# EAGLE design PMT Protector For Optical Stim Gamma1a (EAGLE 8.7.0)

## Sheet 1 of 2
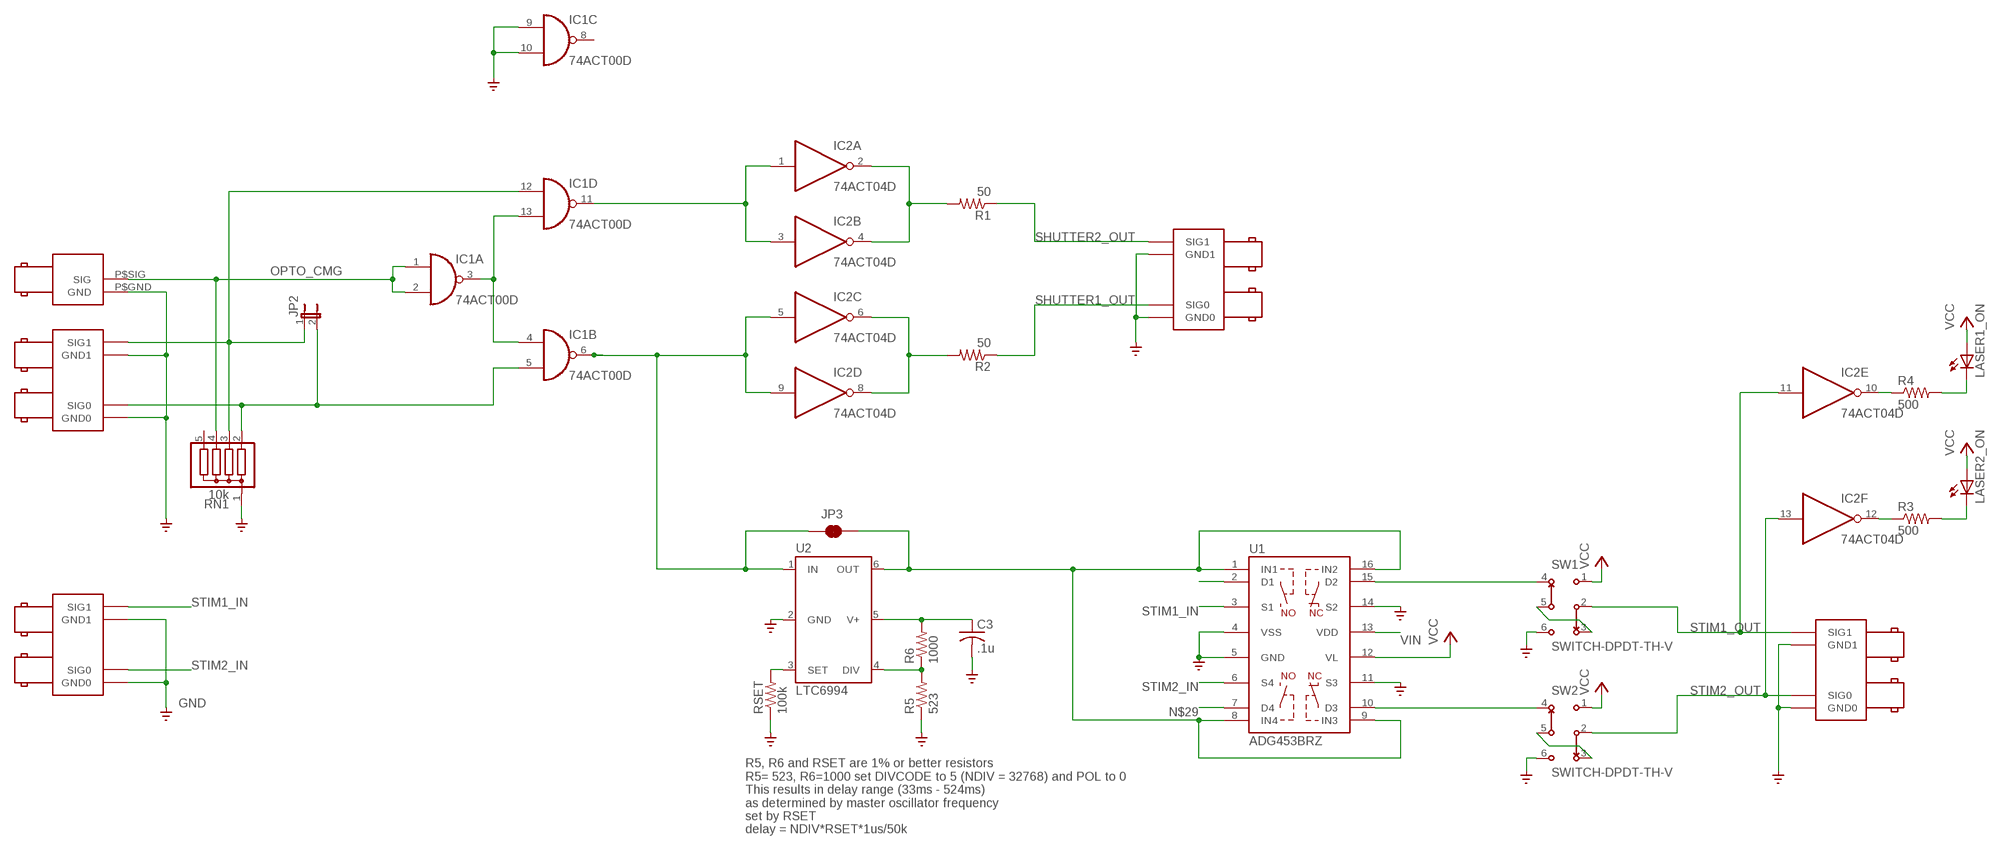
[diagram p0: schematic, sheet 1]

### Parts
C3  .1u  C-USC0805K  [C0805K]
IC1  74ACT00D  [SO14]
IC2  74ACT04D  [SO14]
JP2  JP1E  [JP1]
JP3  JUMPER-SMT_2_NC_TRACE_SILK  [SMT-JUMPER_2_NC_TRACE_SILK]
LASER1_ON  LED5MM  [LED5MM]
LASER2_ON  LED5MM  [LED5MM]
OPTO_CMG  BNC_RIGHT_ANGLE  [BNC_RIGHT_ANGLE]
R1  50  R-US_R0805  [R0805]
R2  50  R-US_R0805  [R0805]
R3  500  R-US_R0805  [R0805]
R4  500  R-US_R0805  [R0805]
R5  523  R-US_R0805  [R0805]
R6  1000  R-US_R0805  [R0805]
RN1  10k  G04R  [SIL5]
RSET  100k  R-US_R0805  [R0805]
SHTR_IN  BNC_RIGHT_ANGLE_DOUBLE  [BNC_RIGHT_ANGLE_DOUBLE]
SHTR_OUT  BNC_RIGHT_ANGLE_DOUBLE  [BNC_RIGHT_ANGLE_DOUBLE]
STIM_IN  BNC_RIGHT_ANGLE_DOUBLE  [BNC_RIGHT_ANGLE_DOUBLE]
STIM_OUT  BNC_RIGHT_ANGLE_DOUBLE  [BNC_RIGHT_ANGLE_DOUBLE]
SW1  SWITCH-DPDT-TH-V  [SWITCH-DPDT]
SW2  SWITCH-DPDT-TH-V  [SWITCH-DPDT]
U1  ADG453BRZ  [SO16]
U2  LTC6994  TIMERBLOX_LTC6994SOT-23  [SOT23-6]

### Nets
GND: C3.2 IC1.9(C:I0) IC1.10(C:I1) OPTO_CMG.P$GND(GND) R5.1 RN1.1 RSET.1 SHTR_IN.P$GND0(GND0) SHTR_IN.P$GND1(GND1) SHTR_OUT.P$GND0(GND0) SHTR_OUT.P$GND1(GND1) STIM_IN.P$GND0(GND0) STIM_IN.P$GND1(GND1) STIM_OUT.P$GND0(GND0) STIM_OUT.P$GND1(GND1) SW1.6 SW2.6 U1.4(VSS) U1.5(GND) U1.11(S3) U1.14(S2) U2.2(GND) ; also sheet 2
N$1: IC1.12(D:I0) JP2.1 RN1.3 SHTR_IN.P$SIG1(SIG1)
N$2: IC2.12(F:O) R3.1
N$3: IC1.6(B:O) IC2.5(C:I) IC2.9(D:I) JP3.1 U2.1(IN)
N$4: IC2.2(A:O) IC2.4(B:O) R1.2
N$5: IC2.10(E:O) R4.1
N$6: LASER1_ON.K(C) R4.2
N$7: LASER2_ON.K(C) R3.2
N$8: SW2.3 SW2.5
N$9: IC1.11(D:O) IC2.1(A:I) IC2.3(B:I)
N$11: IC2.6(C:O) IC2.8(D:O) R2.2
N$23: IC1.3(A:O) IC1.4(B:I0) IC1.13(D:I1)
N$29: SW2.4 U1.7(D4) U1.10(D3)
N$33: JP3.2 U1.1(IN1) U1.8(IN4) U1.9(IN3) U1.16(IN2) U2.6(OUT)
N$34: SW1.3 SW1.5
N$35: SW1.4 U1.2(D1) U1.15(D2)
N$41: R5.2 R6.1 U2.4(DIV)
N$42: RSET.2 U2.3(SET)
OPTO_CMG: IC1.1(A:I0) IC1.2(A:I1) OPTO_CMG.P$SIG(SIG) RN1.4
SHUTTER1_OUT: R2.1 SHTR_OUT.P$SIG0(SIG0)
SHUTTER2_OUT: R1.1 SHTR_OUT.P$SIG1(SIG1)
SHUTTER_IN: IC1.5(B:I1) JP2.2 RN1.2 SHTR_IN.P$SIG0(SIG0)
STIM1_IN: STIM_IN.P$SIG1(SIG1) U1.3(S1)
STIM1_OUT: IC2.11(E:I) STIM_OUT.P$SIG1(SIG1) SW1.2
STIM2_IN: STIM_IN.P$SIG0(SIG0) U1.6(S4)
STIM2_OUT: IC2.13(F:I) STIM_OUT.P$SIG0(SIG0) SW2.2
VCC: LASER1_ON.A LASER2_ON.A SW1.1 SW2.1 U1.12(VL) ; also sheet 2
VCC2: C3.1 R6.2 U2.5(V+)
VIN: U1.13(VDD) ; also sheet 2
Unconnected: IC1.8(C:O) RN1.5

### Notes on the sheet
- R5, R6 and RSET are 1% or better resistors 
  R5= 523, R6=1000 set DIVCODE to 5 (NDIV = 32768) and POL to 0
  This results in delay range (33ms - 524ms)
  as determined by master oscillator frequency
  set by RSET
  delay = NDIV*RSET*1us/50k

## Sheet 2 of 2
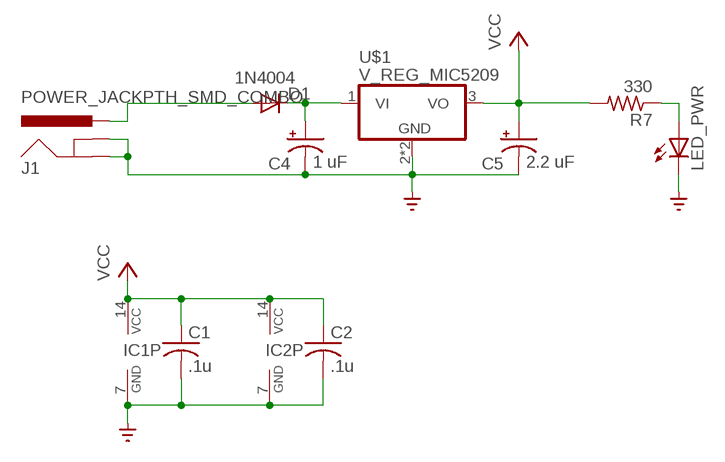
[diagram p1: schematic, sheet 2]

### Parts
C1  .1u  C-USC0805K  [C0805K]
C2  .1u  C-USC0805K  [C0805K]
C4  1 uF  CPOL-USE2.5-5  [E2,5-5]
C5  2.2 uF  CPOL-USE2.5-5  [E2,5-5]
D1  1N4004  [DO41-10]
J1  POWER_JACKPTH_SMD_COMBO  [POWER_JACK_COMBO]
LED_PWR  LED5MM  [LED5MM]
R7  330  R-US_R0805  [R0805]
U$1  V_REG_MIC5209  [SOT-223]

### Nets
GND: C1.2 C2.2 C4.- C5.- IC1.7(P:GND) IC2.7(P:GND) J1.GND(GNDBREAK) J1.GND@1(GND) LED_PWR.K(C) U$1.2(GND) U$1.4(GND) ; also sheet 1
N$31: D1.A J1.POWER(PWR)
N$61: LED_PWR.A R7.1
VCC: C1.1 C2.1 C5.+ IC1.14(P:VCC) IC2.14(P:VCC) R7.2 U$1.3(VO) ; also sheet 1
VIN: C4.+ D1.C U$1.1(VI) ; also sheet 1

## Library data of the parts
C1-C3 = adafruit:C-US: CAPACITOR, American symbol
C4 C5 = adafruit:CPOL-US: POLARIZED CAPACITOR, American symbol
D1 = adafruit:1N4004: DIODE General purpose 1N400x type rectifier (With bigger pads) http://www.ladyada.net/library/pcb/eaglelibrary.html
IC1 = 74xx-eu:74*00: Quad 2-input NAND gate
IC2 = 74xx-eu:74*04: Hex INVERTER
J1 = SparkFun-Connectors:POWER_JACK: Power Jack Connector This is the standard 5.5mm barrel jack for power. The PTH is the most common, proven, reliable, footprint. The Slot footprint only works if the mill layer is transmitted to the PCB fab house so be warned. Here are the connectors we sell at SparkFun: DC Barrel Power Jack/Connector <https://www.sparkfun.com/products/119> (PRT-00119) DC Barrel Power Jack/Connector (SMD) <https://www.sparkfun.com/products/12748> (PRT-12748) DC Barrel Jack Adapter - Breadboard Compatible <https://www.sparkfun.com/products/10811> (PRT-10811) It is used on this SparkFun product (and many, many others): SparkFun RedBoard - Programmed with Arduino <https://www.sparkfun.com/products/12757> (DEV-12757) Also, if you need a mating power supply or connector, please check these out: Wall Adapter Power Supply - 9VDC 650mA <https://www.sparkfun.com/products/298> (TOL-00298) DC Barrel Jack Adapter - Male <https://www.sparkfun.com/products/10287> (PRT-10287)
JP2 = jumper:JP1E: JUMPER
JP3 = SparkFun-Jumpers:JUMPER-SMT_2_NC_TRACE: Normally closed trace jumper This jumper has a trace between two pads so it's normally closed (NC). Use a razor knife to open the connection. For best results follow the IPC guidelines for cutting traces: Cutout at least 0.063 mm (0.005 in). Remove all loose material to clean up the cut area. Seal the cut with an approved epoxy. Reapply solder to reclose the connection.
LASER1_ON LASER2_ON LED_PWR = adafruit:LED: LED OSRAM: - CHIPLED LG R971, LG N971, LY N971, LG Q971, LY Q971, LO R971, LY R971 LH N974, LH R974 LS Q976, LO Q976, LY Q976 LO Q996 - Hyper CHIPLED LW Q18S LB Q993, LB Q99A, LB R99A - SideLED LS A670, LO A670, LY A670, LG A670, LP A670 LB A673, LV A673, LT A673, LW A673 LH A674 LY A675 LS A676, LA A676, LO A676, LY A676, LW A676 LS A679, LY A679, LG A679 - Hyper Micro SIDELED® LS Y876, LA Y876, LO Y876, LY Y876 LT Y87S - SmartLED LW L88C, LW L88S LB L89C, LB L89S, LG L890 LS L89K, LO L89K, LY L89K LS L896, LA L896, LO L896, LY L896 - TOPLED LS T670, LO T670, LY T670, LG T670, LP T670 LSG T670, LSP T670, LSY T670, LOP T670, LYG T670 LG T671, LOG T671, LSG T671 LB T673, LV T673, LT T673, LW T673 LH T674 LS T676, LA T676, LO T676, LY T676, LB T676, LH T676, LSB T676, LW T676 LB T67C, LV T67C, LT T67C, LS T67K, LO T67K, LY T67K, LW E67C LS E67B, LA E67B, LO E67B, LY E67B, LB E67C, LV E67C, LT E67C LW T67C LS T679, LY T679, LG T679 LS T770, LO T770, LY T770, LG T770, LP T770 LB T773, LV T773, LT T773, LW T773 LH T774 LS E675, LA E675, LY E675, LS T675 LS T776, LA T776, LO T776, LY T776, LB T776 LHGB T686 LT T68C, LB T68C - Hyper Mini TOPLED® LB M676 - Mini TOPLED Santana® LG M470 LS M47K, LO M47K, LY M47K Source: http://www.osram.convergy.de/
OPTO_CMG = connectors:BNC_RIGHT_ANGLE: BNC plug, through-hole, right-angle
R1-R7 RSET = rcl:R-US_: RESISTOR, American symbol; SPICEPREFIX: R
RN1 = resistor-sil:G04R: SIL RESISTOR; OC_FARNELL: unknown; OC_NEWARK: unknown
SHTR_IN SHTR_OUT STIM_IN STIM_OUT = Pavel_Connectors:BNC_RIGHT_ANGLE_DOUBLE
SW1 SW2 = Pavel_ElectroMechanical:SWITCH-DPDT-TH-V: Switch DPDT E-Switch Series 100 DP6 Product https://www.digikey.com/product-detail/en/e-switch/100DP6T1B1M1RE/100DP6T1B1M1RE-ND/3777875 To wire as 3-way SP3T, connect pin 3 and pin 5
U1 = adg451_adg452_adg453:ADG453?: ANALOG DEVICES ADG453 LC2MOS SPST SWITCHES: 2 x NC, 2 x NO "Case View" D=Drain, S=Source Case-Styles BRZ: SOIC 16 Standard Author: Dipl.-Ing. FH Rainer Bayer, rainer.bayer@hs-heilbronn.de
U2 = Pavel_ICs:TIMERBLOX_LTC6994: Liner Technology TimerBlox Delay Block LTC6994, SOT23-6; PROD_ID: IC-08886; VALUE: MCP4725
U$1 = Pavel-PowerIC:V_REG_MIC5209

## Board
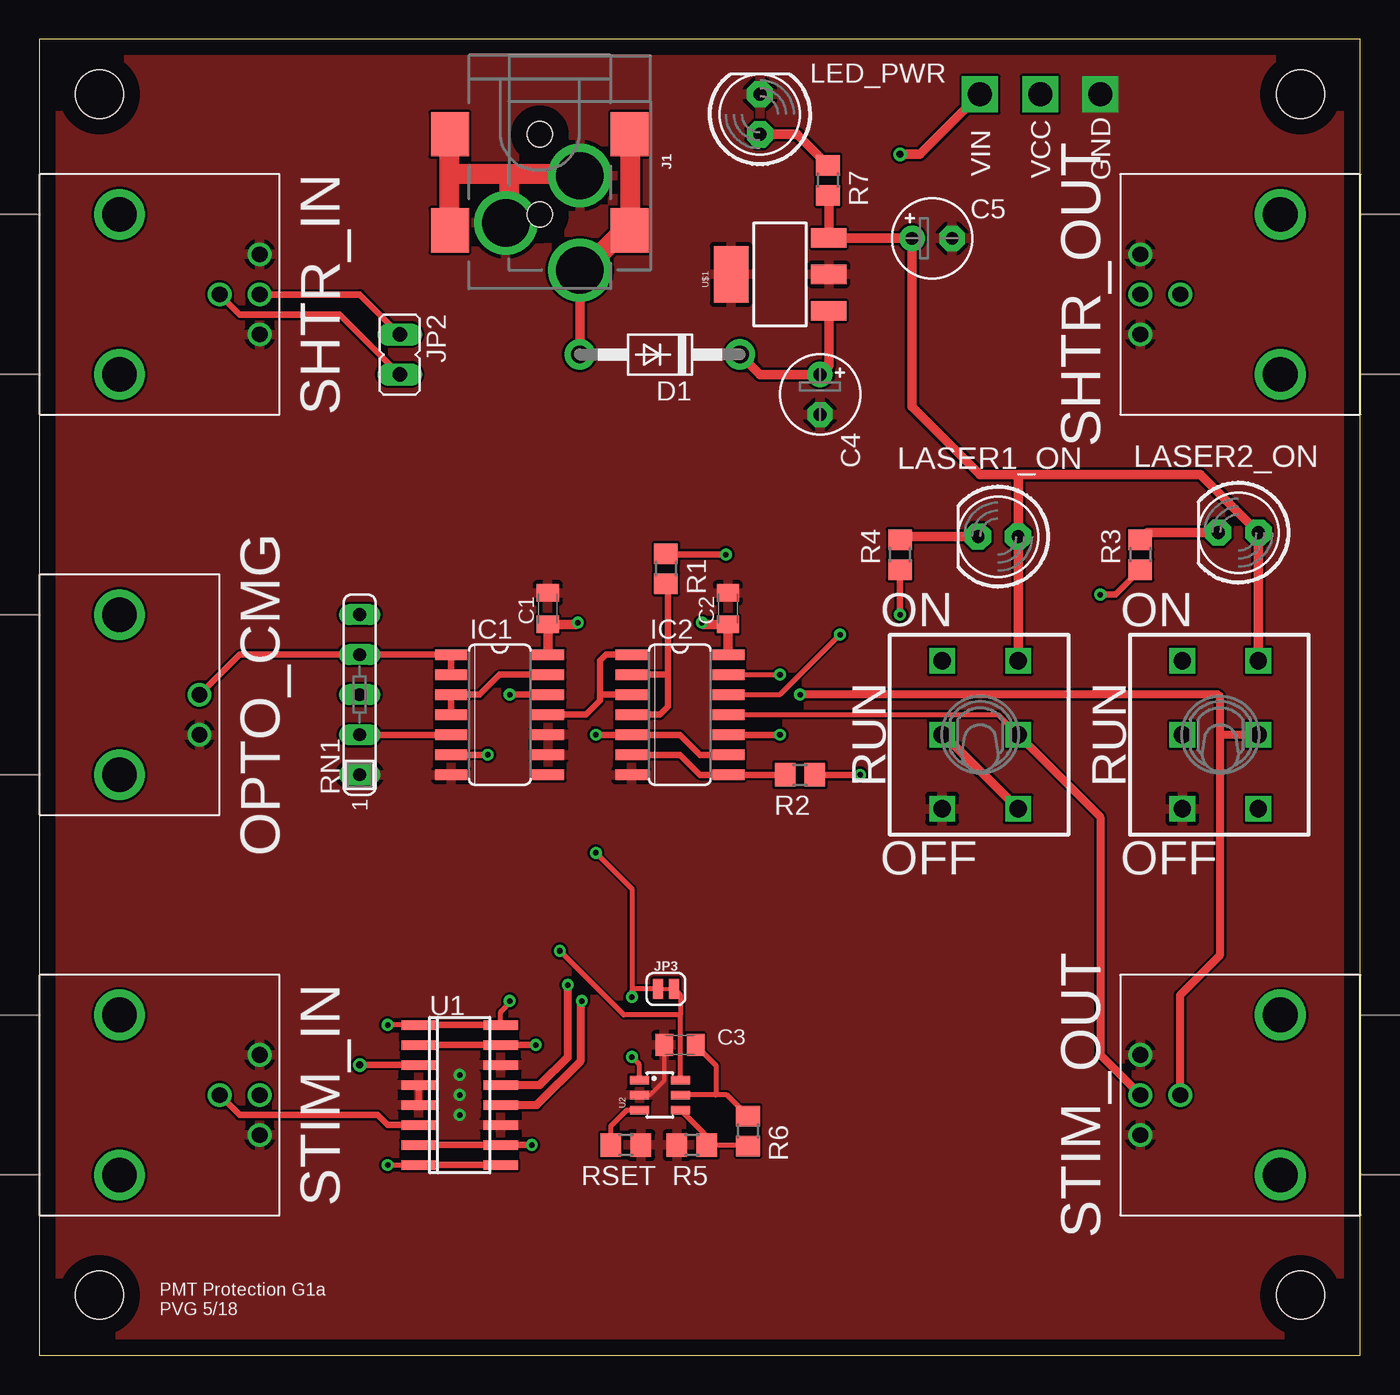
[diagram p2: board, top side]
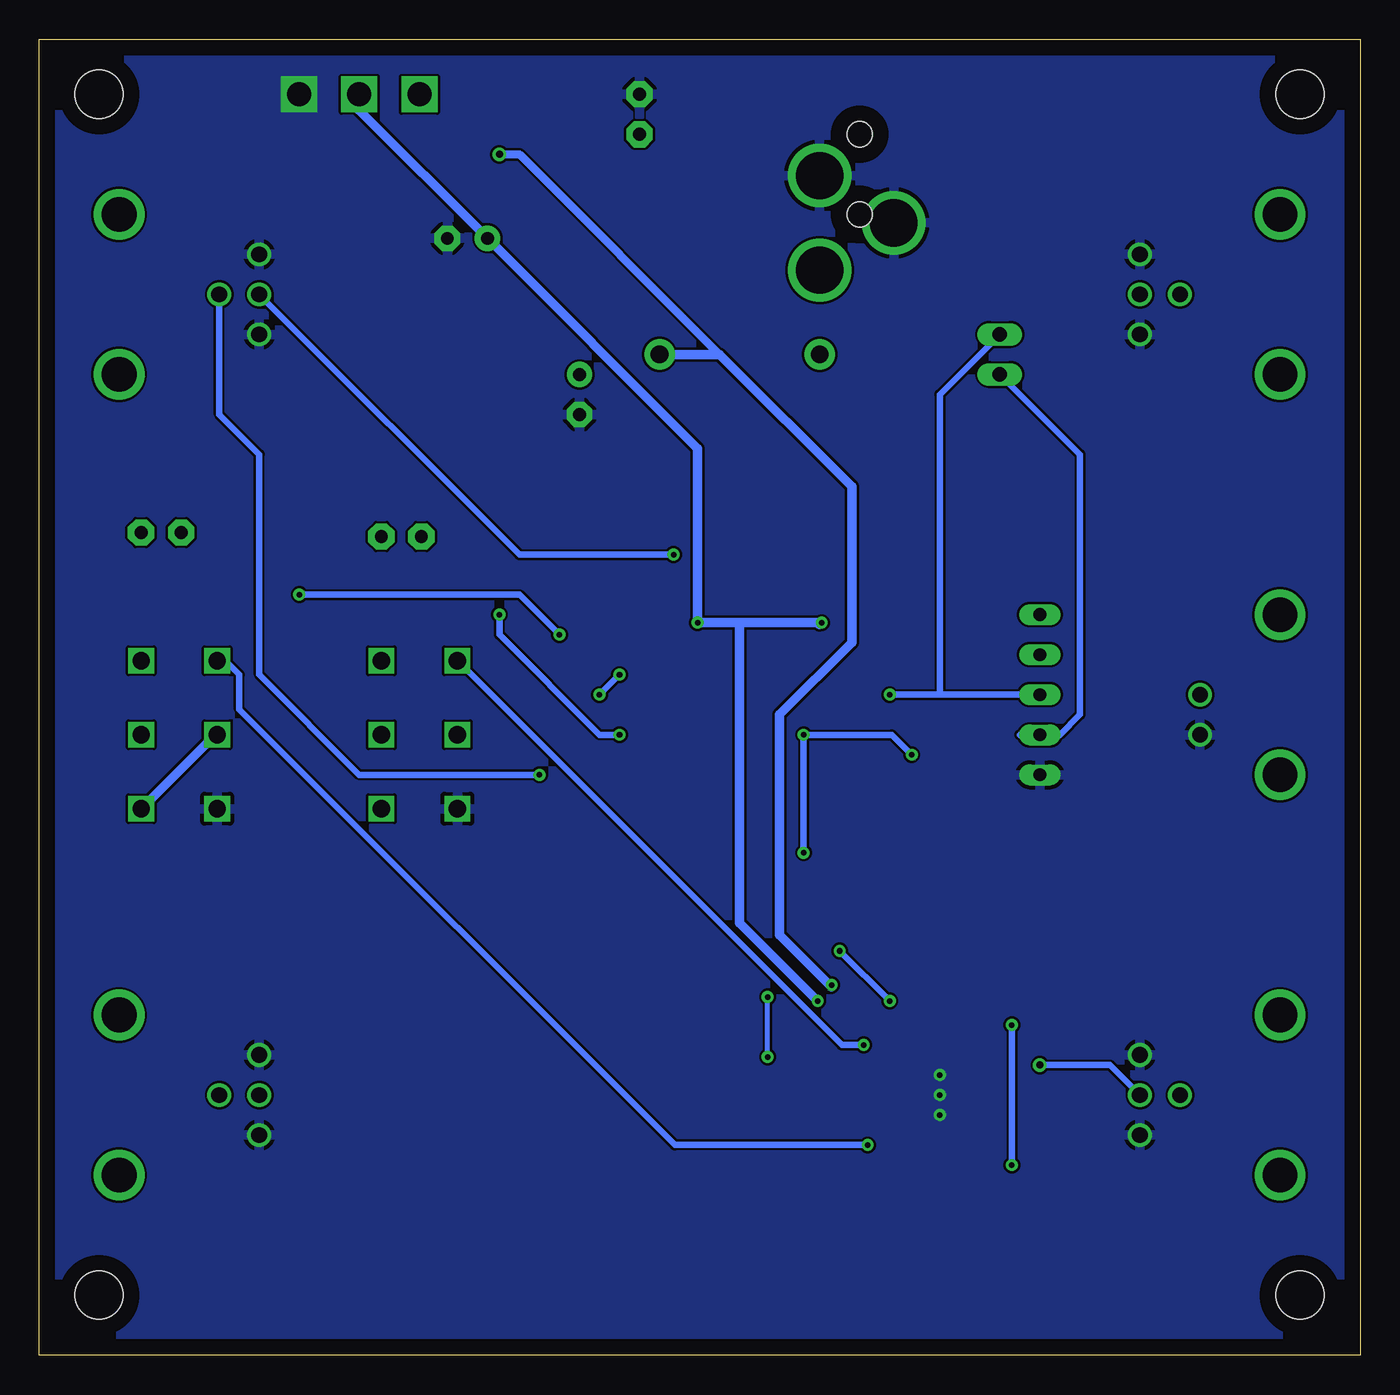
[diagram p3: board, bottom side, seen from below]

Size 83.8 x 83.49 mm. Coordinates in mm from the lower left corner, seen from the top.
Outline: 0,0 83.8,0 83.8,83.49 0,83.49 0,0
Copper layers (1*16): Top 0.035mm / dielectric 1.5mm / Bottom 0.035mm
Design rules "default": minimum track width 6mil, minimum drill 0.35mm, track to track 6mil, track to pad 6mil, pad to pad 6mil, via to via 6mil, smd to smd 6mil, copper to edge 40mil, drill to drill 6mil, minimum pad ring 10mil, minimum via ring 8mil, stop-mask expansion 4mil, vias tented up to drill 0mil, thermal gap 10mil
Holes 3.05 mm at 3.81,3.81 80.01,80.01 3.81,80.01 80.01,3.81

### Footprints (pad centres in the part's own frame; a part is rotated, then mirrored left to right if it is on the bottom)
C0805K = smd 1.1 x 1.4: 1 -1,0; 2 1,0
E2,5-5 = drill 0.813 pad 1.6: + -1.27,0 | drill 0.813 pad 1.6 octagon: - 1.27,0
DO41-10 = drill 1.118 pad 1.93: A 5.08,0; C -5.08,0
SO14 = smd 0.66 x 2.032: 1 -3.81,-3.073; 2 -2.54,-3.073; 3 -1.27,-3.073; 4 0,-3.073; 5 1.27,-3.073; 6 2.54,-3.073; 7 3.81,-3.073; 8 3.81,3.073; 9 2.54,3.073; 10 1.27,3.073; 11 0,3.073; 12 -1.27,3.073; 13 -2.54,3.073; 14 -3.81,3.073
POWER_JACK_COMBO = drill 2.997: GND 5.62,-2.16; GND@1 2.62,2.54; POWER 8.62,2.54 | smd 2.8 x 2.4: GND@3 0,-5.7; GND@4 6.1,-5.7; POWER@1 0,5.7; POWER@2 6.1,5.7 | hole 1.6: 0,0; 5.08,0
JP1 = drill 0.914 long: 1 0,-1.27; 2 0,1.27
SMT-JUMPER_2_NC_TRACE_SILK = smd 0.635 x 1.27: 1 -0.508,0; 2 0.508,0
LED5MM = drill 0.813 pad 1.676 octagon: A -1.27,0; K 1.27,0
BNC_RIGHT_ANGLE = drill 2.2: P$1 -5.08,-6.35; P$2 5.08,-6.35 | drill 1: P$GND -2.54,-11.43; P$SIG 0,-11.43
R0805 = smd 1.3 x 1.5: 1 -0.95,0; 2 0.95,0
SIL5 = drill 0.813 long: 1 -5.08,0; 2 -2.54,0; 3 0,0; 4 2.54,0; 5 5.08,0
BNC_RIGHT_ANGLE_DOUBLE = drill 2.2: P$1 0,-5.08; P$2 0,5.08 | drill 1: P$GND0 8.89,-2.54; P$GND1 8.89,2.54; P$SIG0 6.35,0; P$SIG1 8.89,0
SWITCH-DPDT = drill 1.092 square: 1 2.413,4.699; 2 2.413,0; 3 2.413,-4.699; 4 -2.413,4.699; 5 -2.413,0; 6 -2.413,-4.699
SO16 = smd 0.6 x 2.2: 1 -4.445,-2.6; 2 -3.175,-2.6; 3 -1.905,-2.6; 4 -0.635,-2.6; 5 0.635,-2.6; 6 1.905,-2.6; 7 3.175,-2.6; 8 4.445,-2.6; 9 4.445,2.6; 10 3.175,2.6; 11 1.905,2.6; 12 0.635,2.6; 13 -0.635,2.6; 14 -1.905,2.6; 15 -3.175,2.6; 16 -4.445,2.6
SOT23-6 = smd 0.55 x 1.2: 1 0.95,1.3; 2 0,1.3; 3 -0.95,1.3; 4 -0.95,-1.3; 5 0,-1.3; 6 0.95,-1.3
SOT-223 = smd 1.219 x 2.235: 1 -2.311,-3.099; 2 0,-3.099; 3 2.311,-3.099 | smd 3.6 x 2.2: 4 0,3.099

### Placement (x,y rotation side)
C1  32.26,47.37 90 top
C2  43.69,47.37 90 top
C3  40.64,19.68 180 top
C4  49.53,60.96 270 top
C5  56.64,70.87 0 top
D1  39.37,63.5 180 top
IC1  29.21,40.64 270 top
IC2  40.64,40.64 270 top
J1  31.75,77.47 270 top
JP2  22.86,63.5 180 top
JP3  39.75,23.24 0 top
LASER1_ON  60.83,51.94 180 top
LASER2_ON  76.07,52.2 180 top
LED_PWR  45.72,78.74 90 top
OPTO_CMG  -1.27,41.91 90 top
R1  39.75,49.91 270 top
R2  48.26,36.83 180 top
R3  69.85,50.8 90 top
R4  54.61,50.8 90 top
R5  41.4,13.34 0 top
R6  44.96,14.22 90 top
R7  50.04,74.55 270 top
RN1  20.32,41.91 90 top
RSET  37.21,13.34 180 top
SHTR_IN  5.08,67.31 0 top
SHTR_OUT  78.74,67.31 180 top
STIM_IN  5.08,16.51 0 top
STIM_OUT  78.74,16.51 180 top
SW1  59.69,39.37 0 top
SW2  74.93,39.37 0 top
U1  26.67,16.51 270 top
U2  39.37,16.51 90 top
U$1  46.99,68.58 90 top

### Tracks (layer width: path | path; a pad name or v marks a point on that pad's centre or on a via)
GND  (via drill 0.35, 1.52)
  Top 0.254: C3.2 39.64,17.41 38.73,16.51
  Top 0.406: U1.4 U1.5
  other vias: 26.67,17.78 26.67,16.51 26.67,15.24 67.31,80.01
  pour Top: -1.27,86.36 87.63,86.36 87.63,-3.81 -1.27,-3.81
  pour Bottom: -1.27,86.36 86.36,86.36 86.36,-2.54 -1.27,-2.54
N$1  (via drill 0.35)
  Top 0.406: SHTR_IN.P$SIG1 20.32,67.31 JP2.1 | IC1.12 v29.84,41.91
  Bottom 0.406: v29.84,41.91 26.67,41.91 | 26.67,41.91 RN1.3 | JP2.1 26.67,60.96 26.67,41.91
N$2  (via drill 0.35)
  Top 0.305: IC2.12 46.99,41.91 v50.8,45.72
  Top 0.406: 69.85,49.53 R3.1 68.26,48.26 v67.31,48.26
  Bottom 0.406: v67.31,48.26 53.34,48.26 v50.8,45.72
N$3  (via drill 0.35)
  Top 0.305: U2.1 38.07,18.45 v37.59,18.92 | v35.31,31.88 37.59,29.59 37.59,23.11 | 37.59,23.11 v37.59,22.73 | JP3.1 37.72,23.24 37.59,23.11
  Top 0.406: IC2.9 41.91,38.1 40.64,39.37 IC2.5 v35.31,39.37 | v28.45,38.1 IC1.6
  Bottom 0.305: v37.59,18.92 v37.59,22.73
  Bottom 0.406: 28.32,37.97 v28.45,38.1 29.72,39.37 v35.31,39.37 v35.31,31.88
N$4
  Top 0.406: IC2.4 39.37,40.64 39.88,41.15 39.88,43.18 | IC2.2 39.88,43.18 | R1.2 39.88,48.83 39.88,43.18
N$5  (via drill 0.35)
  Top 0.406: IC2.10 v46.99,39.37 | v54.61,46.99 R4.1
  Bottom 0.406: v46.99,39.37 48.26,39.37 54.61,45.72 v54.61,46.99
N$6
  Top 0.61: LASER1_ON.K 54.8,51.94 R4.2
N$7
  Top 0.61: LASER2_ON.K 70.3,52.2 R3.2
N$8
  Bottom 0.61: SW2.3 72.64,39.37 SW2.5
N$9
  Top 0.406: IC1.11 34.67,40.64 35.56,41.53 35.56,41.91 | IC2.1 35.94,44.45 35.56,44.07 35.56,41.91 | 35.56,41.91 IC2.3
N$11
  Top 0.406: IC2.6 40.64,38.1 41.91,36.83 IC2.8 R2.2
N$23
  Top 0.406: IC1.4 IC1.3 27.94,41.91 29.21,43.18 IC1.13
N$29  (via drill 0.35)
  Top 0.406: U1.7 U1.10 v31.24,13.34
  Bottom 0.406: v31.24,13.34 43.48,13.34 71.12,40.98 71.12,43.18 72.01,44.07 SW2.4
N$31
  Top 0.61: J1.POWER D1.A
N$33  (via drill 0.35)
  Top 0.305: U1.1 v22.1,20.95 | v22.1,12.06 U1.8 | U1.16 29.27,21.78 29.84,22.35 v29.84,22.48 | U2.6 40.67,21.59 | 40.67,21.59 40.67,22.86 40.29,23.24 JP3.2 | 40.67,21.59 37.08,21.59 v33.02,25.65
  Top 0.406: U1.8 U1.9 | U1.1 U1.16
  Bottom 0.406: v22.1,20.95 v22.1,12.06 | v29.84,22.48 v33.02,25.65
N$34
  Top 0.61: SW1.3 57.4,39.37 SW1.5
N$35  (via drill 0.35)
  Top 0.406: U1.2 U1.15 v31.5,19.68
  Bottom 0.406: SW1.4 32.89,19.68 v31.5,19.68
N$41
  Top 0.305: U2.4 42.35,13.88 R5.2 44.9,13.34 R6.1
N$42
  Top 0.305: RSET.2 36.26,14.54 37.28,15.56 U2.3
N$61
  Top 0.61: R7.1 48.07,77.47 LED_PWR.A
OPTO_CMG
  Top 0.406: IC1.2 IC1.1 RN1.4 12.7,44.45 OPTO_CMG.P$SIG
SHUTTER1_OUT  (via drill 0.35)
  Top 0.406: R2.1 v52.07,36.83
  Bottom 0.406: SHTR_OUT.P$SIG0 72.39,59.69 69.85,57.15 69.85,43.18 63.5,36.83 v52.07,36.83
SHUTTER2_OUT  (via drill 0.35)
  Top 0.406: v43.56,50.8 39.81,50.8 R1.1
  Bottom 0.406: SHTR_OUT.P$SIG1 53.34,50.8 v43.56,50.8
SHUTTER_IN
  Top 0.406: IC1.5 RN1.2 | SHTR_IN.P$SIG0 12.7,66.04 19.05,66.04 JP2.2
  Bottom 0.406: 21.59,39.37 RN1.2 19.05,39.37 17.78,40.64 17.78,57.15 JP2.2
STIM1_IN  (via drill 0.45)
  Top 0.406: U1.3 v20.32,18.41
  Bottom 0.406: v20.32,18.41 15.88,18.41 STIM_IN.P$SIG1
STIM1_OUT
  Top 0.305: IC2.11 60.83,40.64 SW1.2
  Top 0.508: SW1.2 67.31,34.16 67.31,19.05 STIM_OUT.P$SIG1
STIM2_IN
  Top 0.406: STIM_IN.P$SIG0 12.7,15.24 21.46,15.24 22.1,14.61 U1.6
STIM2_OUT  (via drill 0.35)
  Top 0.305: 74.87,41.85 74.8,41.91 | IC2.13 v46.99,43.18
  Top 0.508: 74.8,41.91 v48.26,41.91 | STIM_OUT.P$SIG0 72.39,22.86 74.93,25.4 74.93,39.37 | 74.93,39.37 74.93,41.78 74.87,41.85 | SW2.2 74.93,39.37
  Bottom 0.406: v48.26,41.91 v46.99,43.18
VCC  (via drill 0.35, 1.52)
  Top 0.508: U1.12 31.56,15.88 34.36,18.68 34.36,22.43
  Top 0.61: R7.2 50.09,73.55 U$1.3 55.35,70.89 C5.+ 55.37,60.2 59.69,55.88 62.23,55.88 | 62.23,55.88 73.66,55.88 LASER2_ON.A SW2.1 | 62.23,55.88 62.1,55.75 LASER1_ON.A SW1.1 | IC1.14 32.28,46.35 C1.1 34.05,46.37 v34.16,46.48 | IC2.14 43.69,44.48 C2.1 42.15,46.37 v42.04,46.48 | 34.36,22.43 v34.42,22.48
  Bottom 0.61: 39.37,46.48 v42.04,46.48 42.04,57.53 C5.+ 63.5,78.99 v63.5,80.01 | 39.37,46.48 v34.16,46.48 34.29,46.35 | v34.42,22.48 39.37,27.43 39.37,46.48
VCC2
  Top 0.305: R6.2 43.62,16.51 42.93,16.51 | 42.93,16.51 U2.5 | C3.1 42.93,18.4 42.93,16.51
VIN  (via drill 0.35, 0.45, 1.52)
  Top 0.508: U1.13 31.75,17.14 33.53,18.92 v33.53,23.5
  Top 0.61: D1.C 45.72,62.23 C4.+ 50.09,62.79 U$1.1 | v59.69,80.01 55.88,76.2 v54.61,76.2
  Bottom 0.508: v54.61,76.2 53.34,76.2 40.64,63.5
  Bottom 0.61: D1.C 40.64,63.5 32.26,55.12 32.26,45.21 36.83,40.64 36.83,26.67 33.53,23.37 v33.53,23.5

### Text on the board
tNames: VIN | VCC | GND | ON | ON | RUN | RUN | OFF | OFF | PMT Protection G1a / PVG 5/18